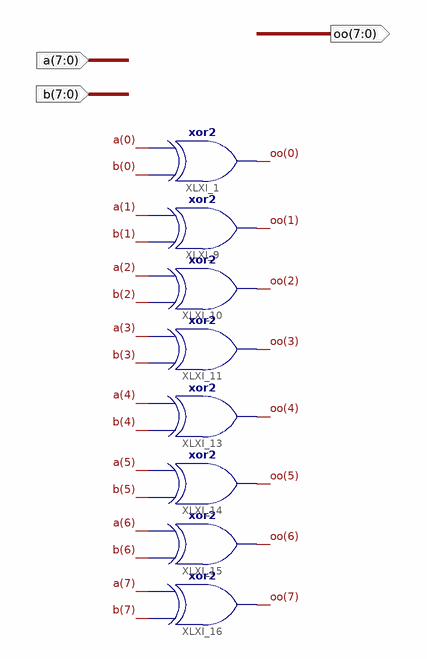
[diagram p0: schematic sheet 1]
// Xilinx ISE schematic xxorrr.sch (spartan6) as structural Verilog: 8 symbols, 3 ports
module xxorrr (
  input  [7:0] a,
  input  [7:0] b,
  output [7:0] oo
);

  xor XLXI_1 (oo[0], b[0], a[0]);
  xor XLXI_9 (oo[1], b[1], a[1]);
  xor XLXI_10 (oo[2], b[2], a[2]);
  xor XLXI_11 (oo[3], b[3], a[3]);
  xor XLXI_16 (oo[7], b[7], a[7]);
  xor XLXI_15 (oo[6], b[6], a[6]);
  xor XLXI_14 (oo[5], b[5], a[5]);
  xor XLXI_13 (oo[4], b[4], a[4]);
endmodule
